# Altium schematic sheet motherpetit.SchDoc
size A4
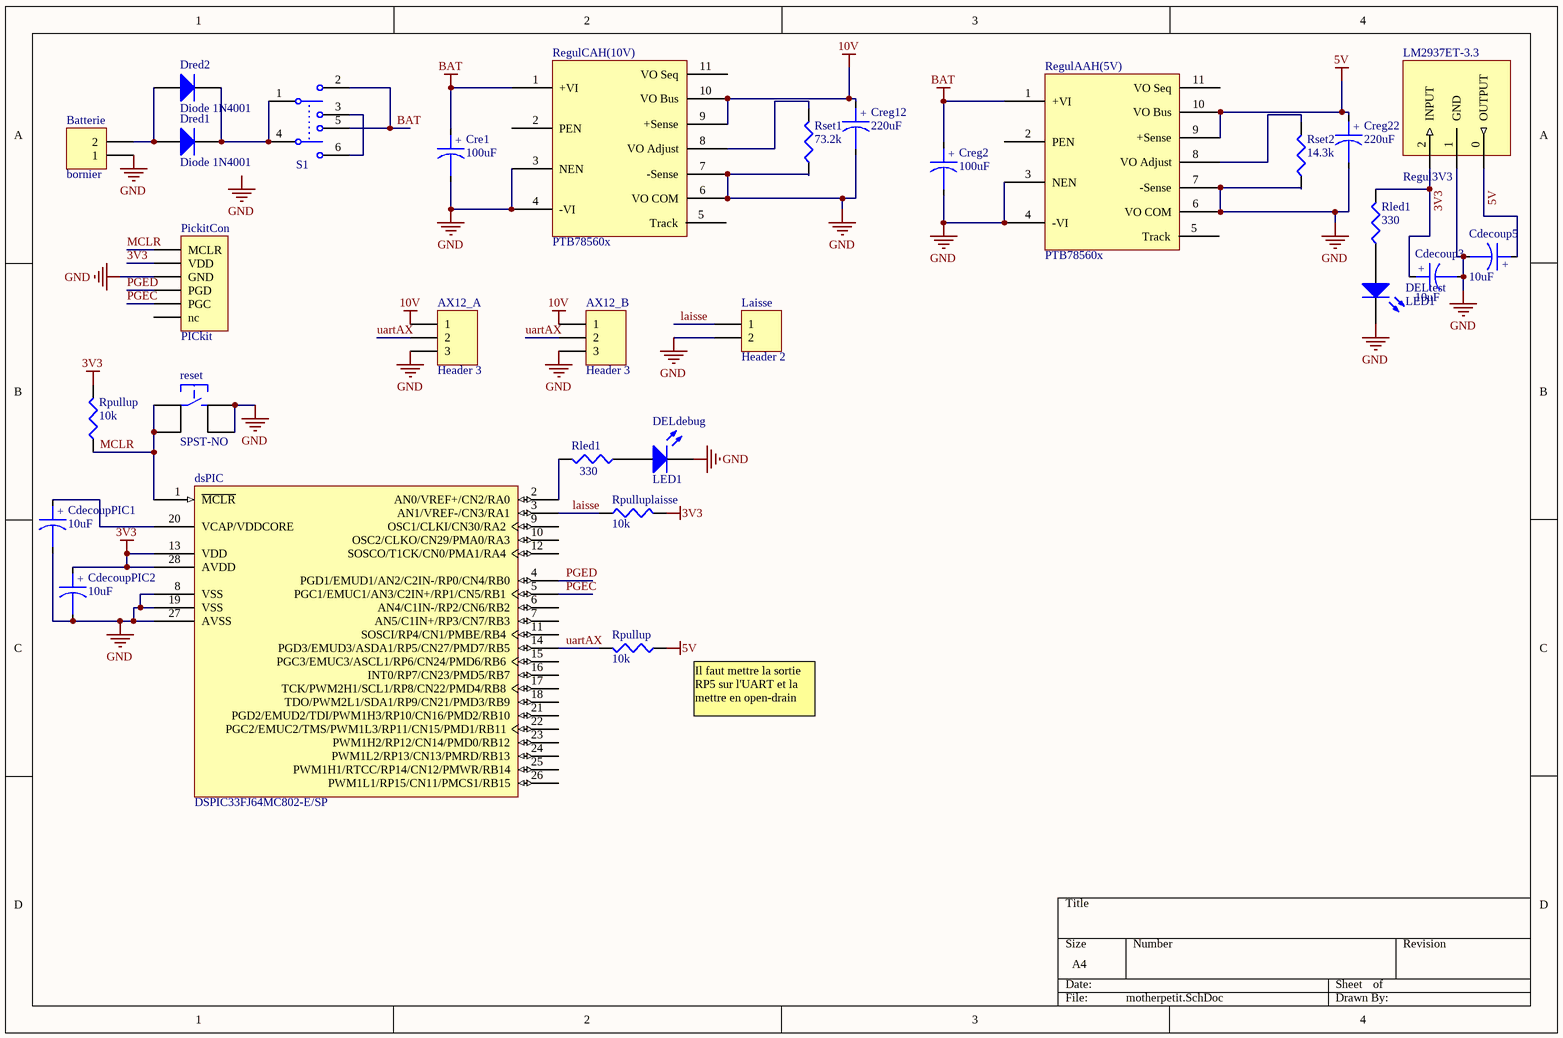
[diagram p0: motherpetit.SchDoc]

## Parts
(Parts that share a designator on the sheet are numbered #1, #2 ... from top to bottom, then left to right.)
AX12_A  Header 3  [HDR1X3]
AX12_B  Header 3  [HDR1X3]
Batterie  bornier  [Bornier male coude 2 voies]
Cdecoup3  value 10uF  [RB.1/.3]  (hidden comment: CAP Pol)
Cdecoup5  value 10uF  [RB.1/.3]  (hidden comment: CAP Pol)
CdecoupPIC1  value 10uF  [RB.1/.3]  (hidden comment: CAP Pol)
CdecoupPIC2  value 10uF  [RB.1/.3]  (hidden comment: CAP Pol)
Cre1  value 100uF  [RB.1/.3]  (hidden comment: CAP Pol)
Creg2  value 100uF  [RB.1/.3]  (hidden comment: CAP Pol)
Creg12  value 220uF  [RB.1/.3]  (hidden comment: CAP Pol)
Creg22  value 220uF  [RB.1/.3]  (hidden comment: CAP Pol)
DELdebug  LED1  [LED-1]
DELtest  LED1  [LED-1]
Dred1  Diode 1N4001  [DO-41]
Dred2  Diode 1N4001  [DO-41]
dsPIC  DSPIC33FJ64MC802-E/SP  [SPDIP300-SP28]
Laisse  Header 2  [HDR1X2]
LM2937ET-3.3  Regul3V3  [TO-220V]
PickitCon  PICkit  [HDR1X6H]
RegulAAH(5V)  PTB78560x  [PTB78560x]
RegulCAH(10V)  PTB78560x  [PTB78560x]
reset  SPST-NO  [SPST-NO]
Rled1#1  value 330  [AXIAL0.8]  (hidden comment: RES)
Rled1#2  value 330  [AXIAL0.8]  (hidden comment: RES)
Rpullup#1  value 10k  [AXIAL0.8]  (hidden comment: RES)
Rpullup#2  value 10k  [AXIAL0.8]  (hidden comment: RES)
Rpulluplaisse  value 10k  [AXIAL0.8]  (hidden comment: RES)
Rset1  value 73.2k  [AXIAL0.8]  (hidden comment: RES)
Rset2  value 14.3k  [AXIAL0.8]  (hidden comment: RES)
S1  SW-DPDT/Reset  [MCLSS22]  (value not drawn)

## Nets
3V3: Cdecoup3.1 CdecoupPIC2.1 dsPIC.13(VDD) dsPIC.28(AVDD) LM2937ET-3.3.2(INPUT) PickitCon.2(VDD) Rled1#1.2 Rpullup#1.2 Rpulluplaisse.2
5V: Cdecoup5.1 Creg22.1 LM2937ET-3.3.0(OUTPUT) RegulAAH(5V).9(+Sense) RegulAAH(5V).10(VO_Bus) Rpullup#2.1
10V: AX12_A.1 AX12_B.1 Creg12.1 RegulCAH(10V).9(+Sense) RegulCAH(10V).10(VO_Bus)
BAT: Cre1.1 Creg2.1 RegulAAH(5V).1(+VI) RegulCAH(10V).1(+VI) S1.2 S1.5
GND: AX12_A.3 AX12_B.3 Batterie.1 Cdecoup3.2 Cdecoup5.2 CdecoupPIC1.2 CdecoupPIC2.2 Cre1.2 Creg2.2 Creg12.2 Creg22.2 DELdebug.2(K) DELtest.2(K) dsPIC.8(VSS) dsPIC.19(VSS) dsPIC.27(AVSS) Laisse.2 LM2937ET-3.3.1(GND) PickitCon.3(GND) RegulAAH(5V).3(NEN) RegulAAH(5V).4(-VI) RegulAAH(5V).6(VO_COM) RegulAAH(5V).7(-Sense) RegulCAH(10V).3(NEN) RegulCAH(10V).4(-VI) RegulCAH(10V).6(VO_COM) RegulCAH(10V).7(-Sense) reset.3 reset.4 Rset1.1 Rset2.1
laisse: dsPIC.3(AN1/VREF-/CN3/RA1) Laisse.1 Rpulluplaisse.1
MCLR: dsPIC.1(~{MCLR}) PickitCon.1(MCLR) reset.1 reset.2 Rpullup#1.1
PGEC: dsPIC.5(PGC1/EMUC1/AN3/C2IN+/RP1/CN5/RB1) PickitCon.5(PGC)
PGED: dsPIC.4(PGD1/EMUD1/AN2/C2IN-/RP0/CN4/RB0) PickitCon.4(PGD)
uartAX: AX12_A.2 AX12_B.2 dsPIC.14(PGD3/EMUD3/ASDA1/RP5/CN27/PMD7/RB5) Rpullup#2.2
NetBatterie_2: Batterie.2 Dred1.1(A) Dred2.1(A)
NetCdecoupPIC1_1: CdecoupPIC1.1 dsPIC.20(VCAP/VDDCORE)
NetDELdebug_1: DELdebug.1(A) Rled1#2.1
NetDELtest_1: DELtest.1(A) Rled1#1.1
NetDred1_2: Dred1.2(K) Dred2.2(K) S1.1 S1.4
NetdsPIC_2: dsPIC.2(AN0/VREF+/CN2/RA0) Rled1#2.2
NetRegulAAH(5V)_8: RegulAAH(5V).8(VO_Adjust) Rset2.2
NetRegulCAH(10V)_8: RegulCAH(10V).8(VO_Adjust) Rset1.2
NetS1_3: S1.3 S1.6

Not connected (* = marked no-connect by the designer): dsPIC 6(AN4/C1IN-/RP2/CN6/RB2) 7(AN5/C1IN+/RP3/CN7/RB3) 9(OSC1/CLKI/CN30/RA2) 10(OSC2/CLKO/CN29/PMA0/RA3) 11(SOSCI/RP4/CN1/PMBE/RB4) 12(SOSCO/T1CK/CN0/PMA1/RA4) 15(PGC3/EMUC3/ASCL1/RP6/CN24/PMD6/RB6) 16(INT0/RP7/CN23/PMD5/RB7) 17(TCK/PWM2H1/SCL1/RP8/CN22/PMD4/RB8) 18(TDO/PWM2L1/SDA1/RP9/CN21/PMD3/RB9) 21(PGD2/EMUD2/TDI/PWM1H3/RP10/CN16/PMD2/RB10) 22(PGC2/EMUC2/TMS/PWM1L3/RP11/CN15/PMD1/RB11) 23(PWM1H2/RP12/CN14/PMD0/RB12) 24(PWM1L2/RP13/CN13/PMRD/RB13) 25(PWM1H1/RTCC/RP14/CN12/PMWR/RB14) 26(PWM1L1/RP15/CN11/PMCS1/RB15); PickitCon 6(nc); RegulAAH(5V) 2(PEN) 5(Track) 11(VO_Seq); RegulCAH(10V) 2(PEN) 5(Track) 11(VO_Seq)

## Notes on the sheet
- (near Rpullup#2) Il faut mettre la sortie RP5 sur l'UART et la mettre en open-drain
- Labels drawn without touching a wire or pin: GND
- (in symbol CAP Pol) +

## Library data of the parts
AX12_A AX12_B = Header 3: Header, 3-Pin; LatestRevisionDate: 17-Jul-2002; LatestRevisionNote: Re-released for DXP Platform.; Publisher: Altium Limited
Batterie Laisse = Header 2: Header, 2-Pin; LatestRevisionDate: 17-Jul-2002; LatestRevisionNote: Re-released for DXP Platform.; Publisher: Altium Limited
Cdecoup3 Cdecoup5 CdecoupPIC1 CdecoupPIC2 Cre1 Creg2 Creg12 Creg22 = CAP Pol: Polarized Capacitor
DELdebug DELtest = LED1: Typical RED GaAs LED; Published: 8-Jun-2000; LatestRevisionDate: 08-Jul-2005; LatestRevisionNote: Mech Layer 1 removed.; PackageReference: LED-1; Publisher: Altium Limited; PackageDescription: LED; 2 Leads
Dred1 Dred2 = Diode 1N4001: 1 Amp General Purpose Rectifier; Published: 8-Jun-2000; LatestRevisionDate: 17-Jul-2002; LatestRevisionNote: Re-released for DXP Platform.; DatasheetVersion: 1998; PackageVersion: Aug-1999; PackageReference: DO-41; Publisher: Altium Limited; PackageDescription: Diode, Axial; Body 5.2 x 2.7 mm (LxDia. max), Lead Dia. 0.86 mm (max); Code_JEDEC: DO-204-AL; ComponentLink1Description: Manufacturer Link; ComponentLink1URL: http://www.fairchildsemi.com/; ComponentLink2Description: Datasheet; ComponentLink2URL: http://www.fairchildsemi.com/ds/1N%2F1N4001.pdf
dsPIC = DSPIC33FJ64MC802-E/SP: High-Performance 16-bit Digital Signal Controller, 64 KB Flash, 16 KB RAM, 28-Pin SPDIP, Extended High Temperature; Published: 2-Dec-2009; DatasheetVersion: revD, Nov-2009; PackageVersion: revBB, Aug-2009; PackageReference: SPDIP300-SP28; Publisher: Altium Limited; PackageDescription: 28-Lead Skinny Plastic Dual In-Line (SP) - 300 mil Body [SPDIP]; Supplier 1: Digi-Key; Supplier Part Number 1: DSPIC33FJ64MC802-E/SP-ND; ComponentLink1Description: Datasheet; ComponentLink1URL: http://ww1.microchip.com/downloads/en/DeviceDoc/70291D.pdf; ComponentLink2Description: Packaging Specification; ComponentLink2URL: http://www.microchip.com/stellent/groups/techpub_sg/documents/packagingspec/en012702.pdf; ComponentLink3Description: Microchip.com Home; ComponentLink3URL: http://www.microchip.com/
LM2937ET-3.3 = LM2937ET-3.3: 3.3V linear Regulator
PickitCon = Header ICSP: Header, 6-Pin, Right Angle; LatestRevisionDate: 17-Jul-2002; LatestRevisionNote: Re-released for DXP Platform.; Publisher: Altium Limited
RegulAAH(5V) RegulCAH(10V) = PTB78560x: Texas Instruments Regulators
reset = SPST-NO: Tactile Switch 7.3mm, SMD
Rled1#1 Rled1#2 Rpullup#1 Rpullup#2 Rpulluplaisse Rset1 Rset2 = RES: Resistor; Published: 8-Jun-2000; LatestRevisionDate: 29-May-2009; LatestRevisionNote: IPC-7351 Footprint Added.; PackageReference: J1-0603; Publisher: Altium Limited; PackageDescription: Chip Resistor
S1 = SW-DPDT: Double-Pole, Double-Throw Switch, ref MCLSS22; Published: 24-Mar-1999; LatestRevisionDate: 17-Jul-2002; LatestRevisionNote: Re-released for DXP Platform.; PackageReference: DPDT-6; Publisher: Altium Limited; PackageDescription: Switch; 6 Leads